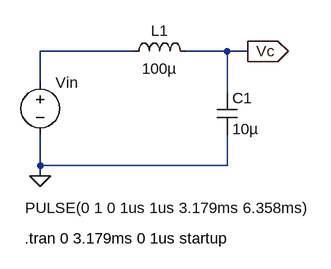
[diagram p0: schematic Lesson22_DC.asc]
Lesson22_DC.asc, the LTspice schematic file:
Version 4
SHEET 1 880 680
WIRE 48 240 -96 240
WIRE 192 240 128 240
WIRE 224 240 192 240
WIRE -96 288 -96 240
WIRE 192 304 192 240
WIRE -96 416 -96 368
WIRE 192 416 192 368
WIRE 192 416 -96 416
WIRE -96 432 -96 416
FLAG 224 240 Vc
IOPIN 224 240 Out
FLAG -96 432 0
SYMBOL voltage -96 272 R0
WINDOW 3 -23 209 Left 2
SYMATTR Value PULSE(0 1 0 1us 1us 3.179ms 6.358ms)
SYMATTR InstName Vin
SYMBOL ind 32 256 R270
WINDOW 0 32 56 VTop 2
WINDOW 3 5 56 VBottom 2
SYMATTR InstName L1
SYMATTR Value 100µ
SYMATTR SpiceLine Ipk=2.6 Rser=83m Rpar=9.42K Cpar=0 mfg="Coilcraft" pn="RFS1412-104"
SYMBOL cap 176 304 R0
SYMATTR InstName C1
SYMATTR Value 10µ
TEXT -120 528 Left 2 !.tran 0 3.179ms 0 1us startup

The netlist it stands for:
* Lesson22_DC.asc
Vin N001 0 PULSE(0 1 0 1us 1us 3.179ms 6.358ms)
L1 N001 Vc 100µ Ipk=2.6 Rser=83m Rpar=9.42K Cpar=0 mfg="Coilcraft" pn="RFS1412-104"
C1 Vc 0 10µ
.tran 0 3.179ms 0 1us startup
.backanno
.end